# EAGLE design SensorConfiguration (EAGLE 6.2)
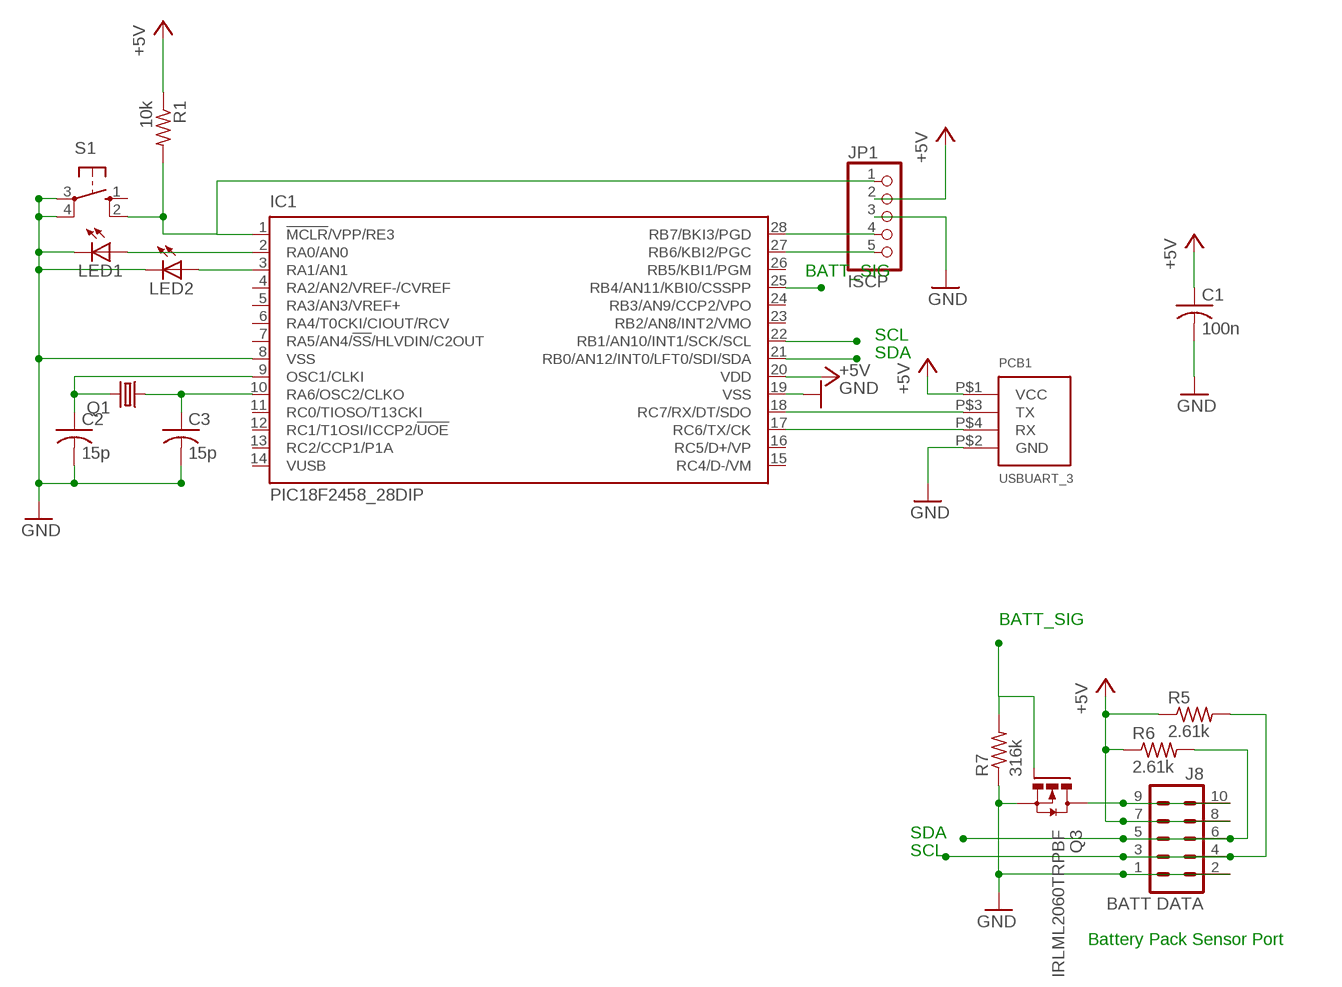
[diagram p0: schematic, sheet 1]

## Parts
C1  100n  C-USC0805  [C0805]
C2  15p  C-USC0805  [C0805]
C3  15p  C-USC0805  [C0805]
IC1  PIC18F2458_28DIP  PIC18F2455_28DIP  [DIL28-3]
J8  BATT DATA  ML10  [ML10]
JP1  ISCP  PINHD-1X5  [1X05]
LED1  LED5MM  [LED5MM]
LED2  LED5MM  [LED5MM]
PCB1  USBUART_3  [UB232R]
Q1  CRYSTALHC49S  [HC49/S]
Q3  IRLML2060TRPBF  [SOT23]
R1  10k  R-US_R0805  [R0805]
R5  2.61k  R-US_R0805  [R0805]
R6  2.61k  R-US_R0805  [R0805]
R7  316k  R-US_R0805  [R0805]
S1  10-XX  [B3F-10XX]

## Nets
+5V: C1.1 IC1.20(VDD) J8.7 J8.8 JP1.2 PCB1.P$1(VCC) R1.1 R5.1 R6.1
BSIG: IC1.25(RB4/AN11/KBI0/CSSPP) Q3.1(G) R7.2
GND: C1.2 C2.2 C3.2 IC1.8(VSS) IC1.19(VSS) J8.1 J8.2 JP1.3 LED1.K(C) LED2.K(C) PCB1.P$2(GND) Q3.2(S) R7.1 S1.3(P) S1.4(P1)
N$1: IC1.27(RB6/KBI2/PGC) JP1.5
N$2: IC1.18(RC7/RX/DT/SDO) PCB1.P$3(TX)
N$3: IC1.17(RC6/TX/CK) PCB1.P$4(RX)
N$4: IC1.28(RB7/BKI3/PGD) JP1.4
N$5: IC1.1(!MCLR!/VPP/RE3) JP1.1 R1.2 S1.2(S1)
N$6: IC1.2(RA0/AN0) LED1.A
N$7: J8.9 J8.10 Q3.3(D)
N$8: IC1.3(RA1/AN1) LED2.A
N$9: C2.1 IC1.9(OSC1/CLKI) Q1.2
N$10: C3.1 IC1.10(RA6/OSC2/CLKO) Q1.1
SCL: IC1.22(RB1/AN10/INT1/SCK/SCL) J8.3 J8.4 R5.2
SDA: IC1.21(RB0/AN12/INT0/LFT0/SDI/SDA) J8.5 J8.6 R6.2
Unconnected: IC1.4(RA2/AN2/VREF-/CVREF) IC1.5(RA3/AN3/VREF+) IC1.6(RA4/T0CKI/CIOUT/RCV) IC1.7(RA5/AN4/!SS!/HLVDIN/C2OUT) IC1.11(RC0/TIOSO/T13CKI) IC1.12(RC1/T1OSI/ICCP2/!UOE) IC1.13(RC2/CCP1/P1A) IC1.14(VUSB) IC1.15(RC4/D-/VM) IC1.16(RC5/D+/VP) IC1.23(RB2/AN8/INT2/VMO) IC1.24(RB3/AN9/CCP2/VPO) IC1.26(RB5/KBI1/PGM) S1.1(S)

## Notes on the sheet
- BATT_SIG
- SCL
- SDA
- BATT_SIG
- SDA
- SCL
- Battery Pack Sensor Port

## Library data of the parts
C1-C3 = resistor:C-US: CAPACITOR, American symbol
IC1 = microchip:PIC18F2*_28: USB Microcontrollers with nanoWatt Technology High-Performance, Enhanced Flash, 28/40/44-Pin, Source: http://ww1.microchip.com/downloads/en/devicedoc/39632c.pdf; MF: MICROCHIP; MPN: PIC18F2455-I/SP; OC_FARNELL: 1579600; OC_NEWARK: 01M8485
J8 = con-ml:ML10: HARTING; OC_FARNELL: unknown; OC_NEWARK: unknown
JP1 = pinhead:PINHD-1X5: PIN HEADER
LED1 LED2 = led:LED: LED OSRAM: - CHIPLED LG R971, LG N971, LY N971, LG Q971, LY Q971, LO R971, LY R971 LH N974, LH R974 LS Q976, LO Q976, LY Q976 LO Q996 - Hyper CHIPLED LW Q18S LB Q993, LB Q99A, LB R99A - SideLED LS A670, LO A670, LY A670, LG A670, LP A670 LB A673, LV A673, LT A673, LW A673 LH A674 LY A675 LS A676, LA A676, LO A676, LY A676, LW A676 LS A679, LY A679, LG A679 - Hyper Micro SIDELED® LS Y876, LA Y876, LO Y876, LY Y876 LT Y87S - SmartLED LW L88C, LW L88S LB L89C, LB L89S, LG L890 LS L89K, LO L89K, LY L89K LS L896, LA L896, LO L896, LY L896 - TOPLED LS T670, LO T670, LY T670, LG T670, LP T670 LSG T670, LSP T670, LSY T670, LOP T670, LYG T670 LG T671, LOG T671, LSG T671 LB T673, LV T673, LT T673, LW T673 LH T674 LS T676, LA T676, LO T676, LY T676, LB T676, LH T676, LSB T676, LW T676 LB T67C, LV T67C, LT T67C, LS T67K, LO T67K, LY T67K, LW E67C LS E67B, LA E67B, LO E67B, LY E67B, LB E67C, LV E67C, LT E67C LW T67C LS T679, LY T679, LG T679 LS T770, LO T770, LY T770, LG T770, LP T770 LB T773, LV T773, LT T773, LW T773 LH T774 LS E675, LA E675, LY E675, LS T675 LS T776, LA T776, LO T776, LY T776, LB T776 LHGB T686 LT T68C, LB T68C - Hyper Mini TOPLED® LB M676 - Mini TOPLED Santana® LG M470 LS M47K, LO M47K, LY M47K Source: http://www.osram.convergy.de LUXEON: - LUMILED® LXK2-PW12-R00, LXK2-PW12-S00, LXK2-PW14-U00, LXK2-PW14-V00 LXK2-PM12-R00, LXK2-PM12-S00, LXK2-PM14-U00 LXK2-PE12-Q00, LXK2-PE12-R00, LXK2-PE12-S00, LXK2-PE14-T00, LXK2-PE14-U00 LXK2-PB12-K00, LXK2-PB12-L00, LXK2-PB12-M00, LXK2-PB14-N00, LXK2-PB14-P00, LXK2-PB14-Q00 LXK2-PR12-L00, LXK2-PR12-M00, LXK2-PR14-Q00, LXK2-PR14-R00 LXK2-PD12-Q00, LXK2-PD12-R00, LXK2-PD12-S00 LXK2-PH12-R00, LXK2-PH12-S00 LXK2-PL12-P00, LXK2-PL12-Q00, LXK2-PL12-R00 Source: www.luxeon.com KINGBRIGHT: KA-3528ASYC Source: www.kingbright.com
PCB1 = mscp-usb:USBUART_3
Q1 = crystal:CRYSTAL: CRYSTAL; OC_FARNELL: 1667008; OC_NEWARK: unknown
Q3 = MSCP_2011_v2:IRLML2060
R1 = resistor:R-US_: RESISTOR, American symbol
R5-R7 = rcl:R-US_: RESISTOR, American symbol
S1 = switch-omron:10-XX: OMRON SWITCH; MPN: B3F-1000; OC_FARNELL: 176432; OC_NEWARK: 36M3542

## Board
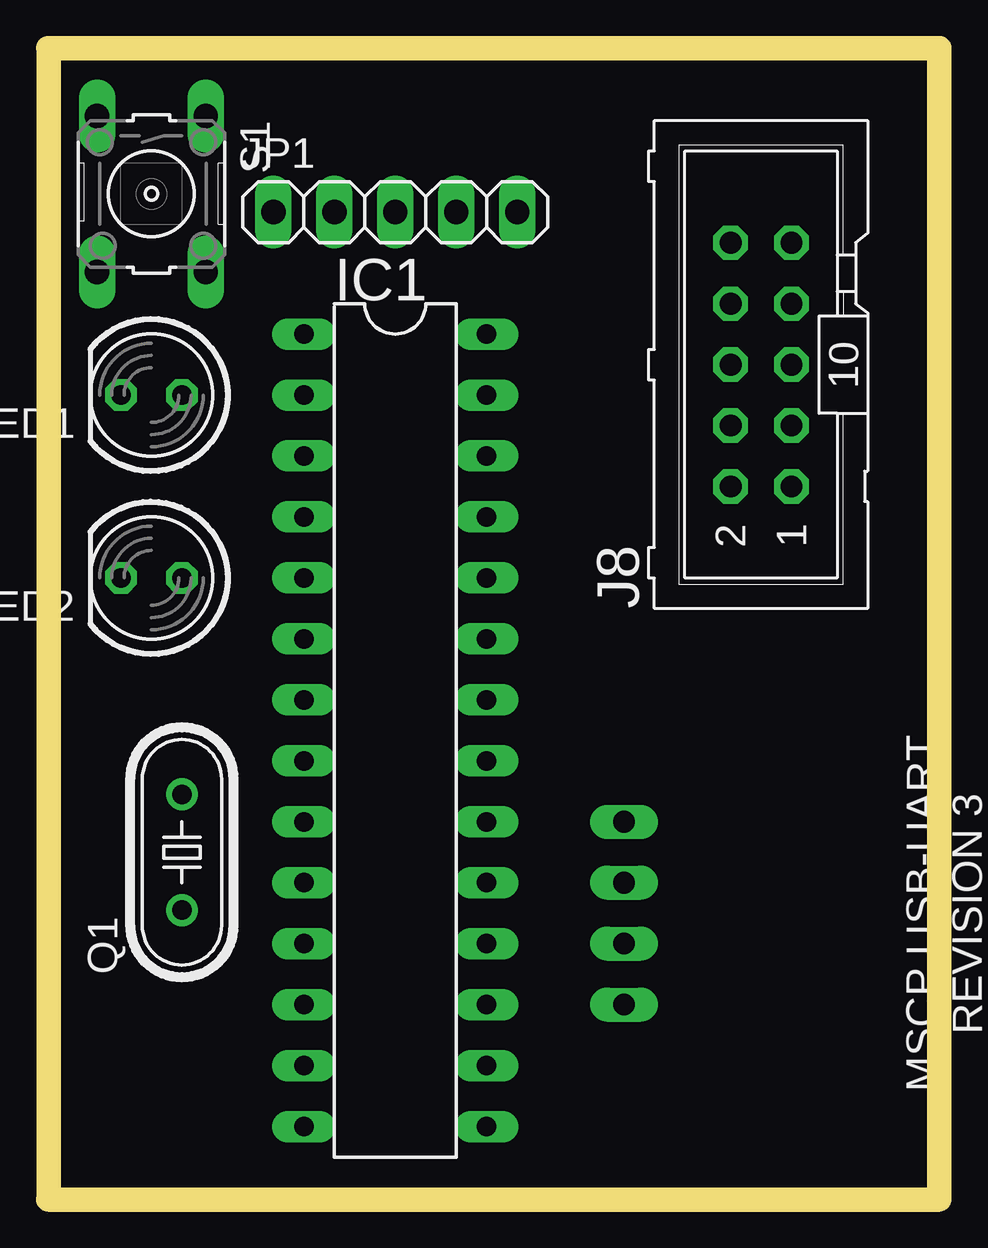
[diagram p1: board, top side]
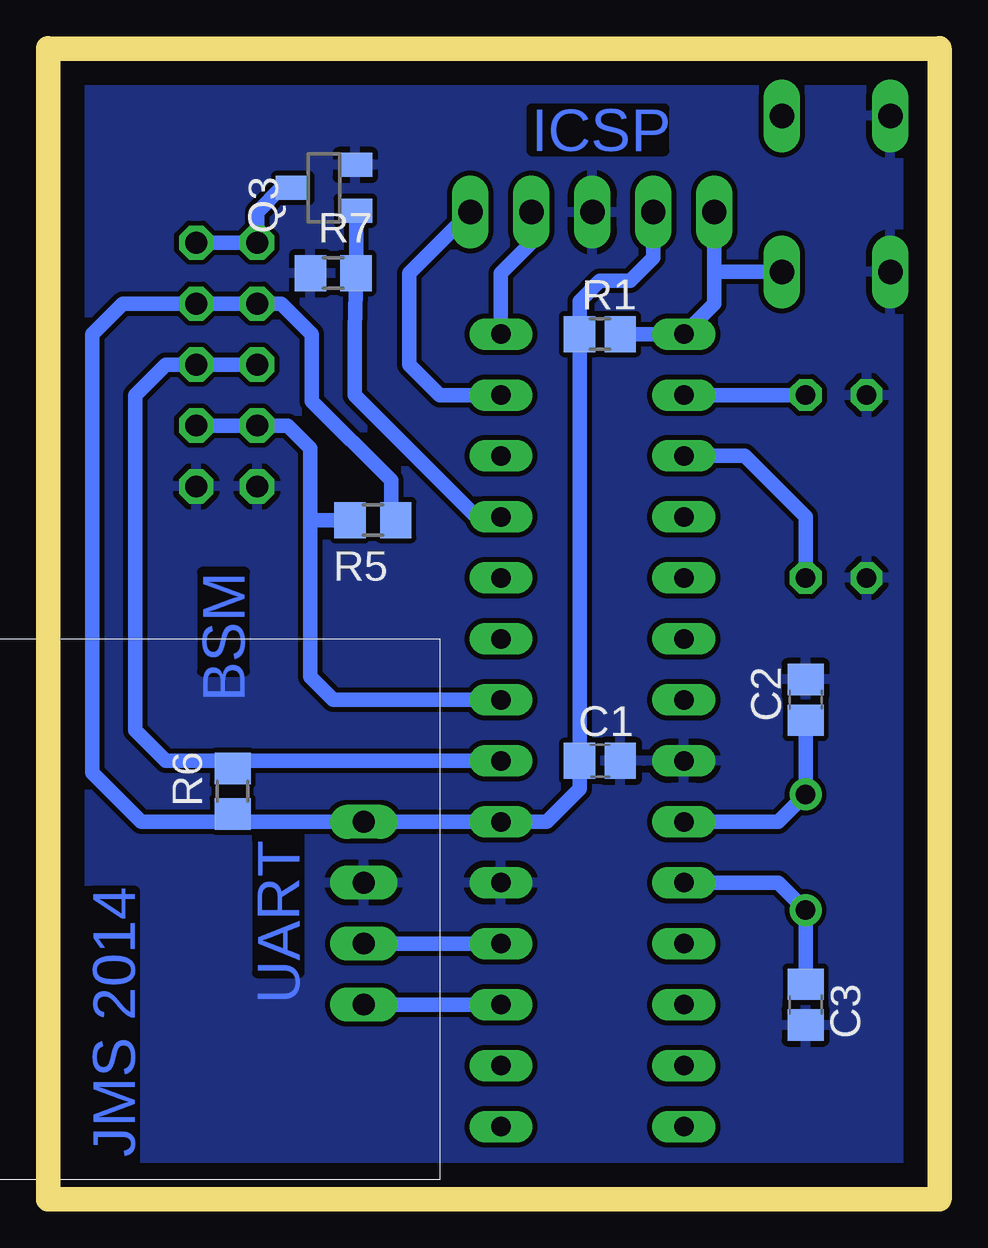
[diagram p2: board, bottom side, seen from below]

Size 36.15 x 46.98 mm. Coordinates in mm from the lower left corner, seen from the top.
Outline: 0,0 36.15,0 36.15,46.98 0,46.98 0,0
Copper layers (1*16): Top 0.035mm / dielectric 1.5mm / Bottom 0.035mm
Design rules: minimum track width 10mil, minimum drill 24mil, track to track 8mil, track to pad 8mil, pad to pad 8mil, via to via 8mil, smd to smd 8mil, copper to edge 40mil, drill to drill 8mil, minimum pad ring 10mil, minimum via ring 8mil, stop-mask expansion 4mil, vias tented up to drill 0mil, thermal gap 10mil
Milling: 4 lines

### Footprints (pad centres in the part's own frame; a part is rotated, then mirrored left to right if it is on the bottom)
C0805 = smd 1.3 x 1.5: 1 -0.85,0; 2 0.85,0
DIL28-3 = drill 0.813 long: 1 -16.51,-3.81; 2 -13.97,-3.81; 3 -11.43,-3.81; 4 -8.89,-3.81; 5 -6.35,-3.81; 6 -3.81,-3.81; 7 -1.27,-3.81; 8 1.27,-3.81; 9 3.81,-3.81; 10 6.35,-3.81; 11 8.89,-3.81; 12 11.43,-3.81; 13 13.97,-3.81; 14 16.51,-3.81; 15 16.51,3.81; 16 13.97,3.81; 17 11.43,3.81; 18 8.89,3.81; 19 6.35,3.81; 20 3.81,3.81; 21 1.27,3.81; 22 -1.27,3.81; 23 -3.81,3.81; 24 -6.35,3.81; 25 -8.89,3.81; 26 -11.43,3.81; 27 -13.97,3.81; 28 -16.51,3.81
ML10 = drill 0.914 octagon: 1 -5.08,-1.27; 2 -5.08,1.27; 3 -2.54,-1.27; 4 -2.54,1.27; 5 0,-1.27; 6 0,1.27; 7 2.54,-1.27; 8 2.54,1.27; 9 5.08,-1.27; 10 5.08,1.27
1X05 = drill 1.016 long: 1 -5.08,0; 2 -2.54,0; 3 0,0; 4 2.54,0; 5 5.08,0
LED5MM = drill 0.813 octagon: A -1.27,0; K 1.27,0
UB232R = drill 0.9 long: P$1 7.62,3.175; P$2 10.16,3.175; P$3 12.7,3.175; P$4 15.24,3.175
HC49/S = drill 0.813: 1 -2.413,0; 2 2.413,0
SOT23 = smd 1 x 1.4: 1 -0.95,-1.306; 2 0.95,-1.306; 3 0,1.306
R0805 = smd 1.3 x 1.5: 1 -0.85,0; 2 0.85,0
R0805' = smd 1.3 x 1.5: 1 -0.95,0; 2 0.95,0
B3F-10XX = drill 1.016 long: 1 -3.251,2.261; 2 3.251,2.261; 3 -3.251,-2.261; 4 3.251,-2.261

### Placement (x,y rotation side)
C1  13.65,17.78 0 bottom
C2  5.08,20.32 90 bottom
C3  5.08,7.62 270 bottom
IC1  13.97,19.05 270 top
J8  29.21,34.29 90 top
JP1  13.97,40.64 0 top
LED1  3.81,33.02 180 top
LED2  3.81,25.4 180 top
PCB1  20.32,22.86 270 top
Q1  5.08,13.97 90 top
Q3  25.15,41.66 90 bottom
R1  13.65,35.56 0 bottom
R5  2.61k  [R0805']  23.11,27.81 180 bottom
R6  2.61k  [R0805']  28.96,16.51 90 bottom
R7  316k  [R0805']  24.77,38.1 0 bottom
S1  3.81,41.4 270 top

### Tracks (layer width: path | path; a pad name or v marks a point on that pad's centre or on a via)
+5V
  Bottom 0.61: JP1.2 11.43,38.73 12.38,37.78 13.65,37.78 14.5,36.93 R1.1 C1.1 14.5,16.61 15.88,15.24 IC1.20 PCB1.P$1 28.64,15.24 R6.1 29.28,15.24 32.77,15.24 34.8,17.27 34.8,35.56 33.53,36.83 J8.7 J8.8 26.92,36.83 25.65,35.56 25.65,32.77 22.35,29.46 22.35,28 R5.1
BSIG
  Bottom 0.61: Q3.1 23.82,40.68 R7.2 23.88,35.75 23.88,33.02 18.8,27.94 IC1.25
GND
  pour Bottom: 0,46.99 38.1,46.99 38.1,0 0,0
N$1
  Bottom 0.61: IC1.27 20.32,33.02 21.59,34.29 21.59,38.1 JP1.5
N$2
  Bottom 0.61: IC1.18 PCB1.P$3
N$3
  Bottom 0.61: IC1.17 PCB1.P$4
N$4
  Bottom 0.61: IC1.28 17.78,38.1 16.51,39.37 JP1.4
N$5
  Bottom 0.61: R1.2 IC1.1 8.89,36.83 8.89,38.1 | JP1.1 8.89,38.1 | S1.2 8.84,38.15 8.89,38.1
N$6
  Bottom 0.61: LED1.A IC1.2
N$7
  Bottom 0.61: Q3.3 26.92,41.66 27.94,40.64 J8.10 J8.9
N$8
  Bottom 0.61: IC1.3 7.62,30.48 5.08,27.94 LED2.A
N$9
  Bottom 0.61: IC1.9 6.22,15.24 Q1.2 C2.1
N$10
  Bottom 0.61: IC1.10 6.22,12.7 Q1.1 C3.1
SCL
  Bottom 0.61: J8.3 J8.4 26.67,31.75 25.72,30.8 25.72,27.69 | 25.72,27.69 25.72,21.27 24.77,20.32 IC1.22 | R5.2 25.59,27.81 25.72,27.69
SDA
  Bottom 0.61: J8.6 J8.5 31.75,34.29 33.02,33.02 33.02,19.05 31.75,17.78 29.28,17.78 R6.2 28.64,17.78 IC1.21

### Text on the board
Bottom: ICSP | BSM | UART | JMS 2014